# EAGLE schematic leddriverv3 (EAGLE 9.4.2)
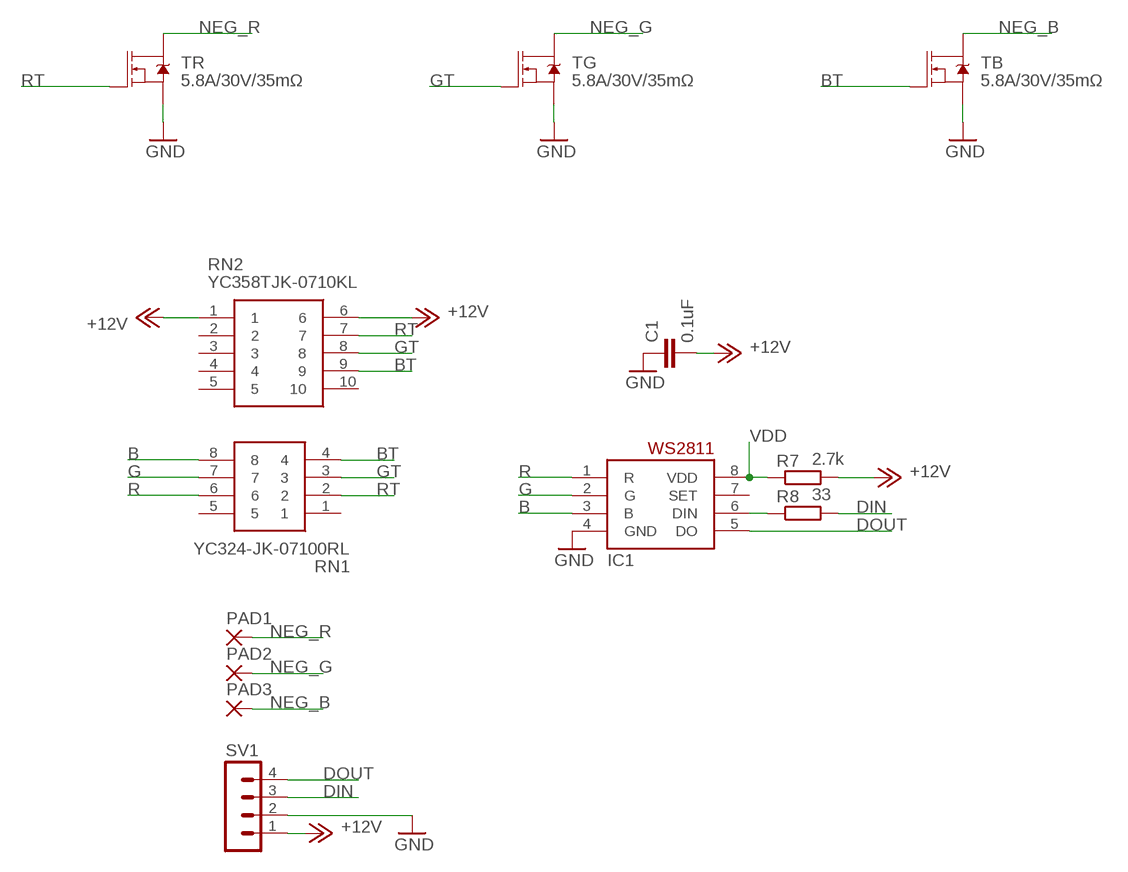
[diagram p0: schematic, sheet 1]

## Parts
C1  0.1uF  C-EUC1206  [C1206]
IC1  WS2811-SOP8  [SO08-SKINNYPADS]
PAD1  3,81/1,4  [3,81/1,4]
PAD2  3,81/1,4  [3,81/1,4]
PAD3  3,81/1,4  [3,81/1,4]
R7  2.7k  R-EU_R0805  [R0805]
R8  33  R-EU_R0805  [R0805]
RN1  YC324-JK-07100RL  [YC324JK07100RL]
RN2  YC358TJK-0710KL  [YC358T]
SV1  MA04-1  [MA04-1]
TB  5.8A/30V/35mΩ  MOSFET-NCH-AO3404A  [SOT23-3]
TG  5.8A/30V/35mΩ  MOSFET-NCH-AO3404A  [SOT23-3]
TR  5.8A/30V/35mΩ  MOSFET-NCH-AO3404A  [SOT23-3]

## Nets
+12V: C1.2 R7.2 RN2.1 RN2.6 SV1.1
B: IC1.3(B) RN1.8
BT: RN1.4 RN2.9 TB.1(G)
DIN: R8.2 SV1.3
DOUT: IC1.5(DO) SV1.4
G: IC1.2(G) RN1.7
GND: C1.1 IC1.4(GND) SV1.2 TB.2(S) TG.2(S) TR.2(S)
GT: RN1.3 RN2.8 TG.1(G)
N$1: IC1.6(DIN) R8.1
NEG_B: PAD3.1(P) TB.3(D)
NEG_G: PAD2.1(P) TG.3(D)
NEG_R: PAD1.1(P) TR.3(D)
R: IC1.1(R) RN1.6
RT: RN1.2 RN2.7 TR.1(G)
VDD: IC1.8(VDD) R7.1
Unconnected: IC1.7(SET) RN1.1 RN1.5 RN2.2 RN2.3 RN2.4 RN2.5 RN2.10

## Library data of the parts
C1 = rcl:C-EU: CAPACITOR, European symbol; SPICEPREFIX: C
IC1 = adafruit_wsled:WS2811
PAD1-PAD3 = wirepad:3,81/1,4: THROUGH-HOLE PAD
R7 R8 = rcl:R-EU_: RESISTOR, European symbol; SPICEPREFIX: R
RN1 = SamacSys_Parts:YC324-JK-07100RL: Resistor Networks & Arrays Source: Datasheet <https://componentsearchengine.com/Datasheets/1/YC324-JK-07100RL.pdf>; DESCRIPTION: Resistor Networks & Arrays; HEIGHT: 0.6mm; MANUFACTURER_NAME: YAGEO (PHYCOMP); MANUFACTURER_PART_NUMBER: YC324-JK-07100RL; MOUSER_PART_NUMBER: 603-YC324-JK-07100RL; MOUSER_PRICE-STOCK: https://www.mouser.com/Search/Refine.aspx?Keyword=603-YC324-JK-07100RL
RN2 = SamacSys_Parts:YC358TJK-0710KL: Resistor Networks & Arrays 10K 5% CONVEX SQUARE 8X1225 Source: Datasheet <https://componentsearchengine.com/Datasheets/1/YC358TJK-0710KL.pdf>; DESCRIPTION: Resistor Networks & Arrays 10K 5% CONVEX SQUARE 8X1225; HEIGHT: mm; MANUFACTURER_NAME: YAGEO (PHYCOMP); MANUFACTURER_PART_NUMBER: YC358TJK-0710KL; MOUSER_PART_NUMBER: 603-YC358TJK-0710KL; MOUSER_PRICE-STOCK: https://www.mouser.com/Search/Refine.aspx?Keyword=603-YC358TJK-0710KL
SV1 = con-lstb:MA04-1: PIN HEADER; OC_FARNELL: unknown; OC_NEWARK: unknown
TB TG TR = SparkFun-DiscreteSemi:MOSFET-NCH: N-channel MOSFETs Voltage controlled devices that allow control of high current outputs. SparkFun Products: SparkFun OpenScale <https://www.sparkfun.com/products/13261> SparkFun Digital Sandbox <https://www.sparkfun.com/products/12651> SparkFun Monster Moto Shield <https://www.sparkfun.com/products/10182> SparkFun MOSFET Power Controller <https://www.sparkfun.com/products/11214>; PROD_ID: TRANS-12988